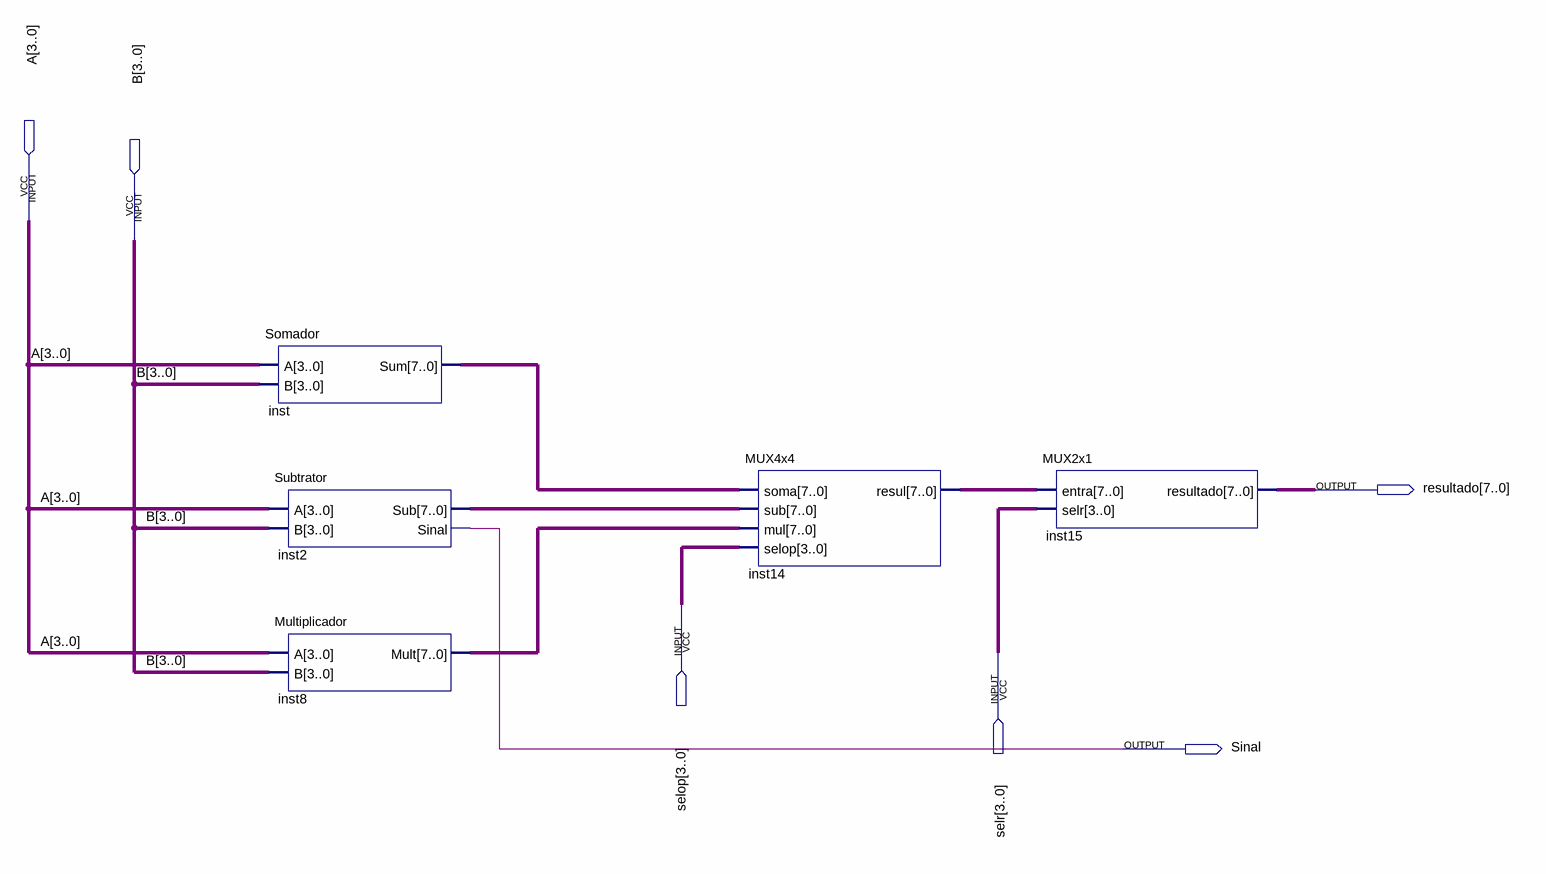
[diagram p0: schematic sheet]
// Quartus schematic ULA_SINAL.bdf as structural Verilog: 5 symbols, 6 pins
module ULA_SINAL (
  input  [3:0] A,
  input  [3:0] B,
  input  [3:0] selop,
  input  [3:0] selr,
  output [7:0] resultado,
  output Sinal
);

  wire [7:0] inst2_sub, inst8_mult, inst14_resul, inst_sum;

  Somador inst (.A(A), .B(B), .Sum(inst_sum));
  Subtrator inst2 (.A(A), .B(B), .Sub(inst2_sub), .Sinal(Sinal));
  Multiplicador inst8 (.A(A), .B(B), .Mult(inst8_mult));
  MUX4x4 inst14 (.soma(inst_sum), .sub(inst2_sub), .mul(inst8_mult), .selop(selop), .resul(inst14_resul));
  MUX2x1 inst15 (.entra(inst14_resul), .selr(selr), .resultado(resultado));
endmodule
